# EasyEDA schematic SCH_hackercard_2026-05-06.json
TITLE: Sheet_1; REV: 1.0; Date: 2026-04-28; Sheet: 1/1; Company: Your Company
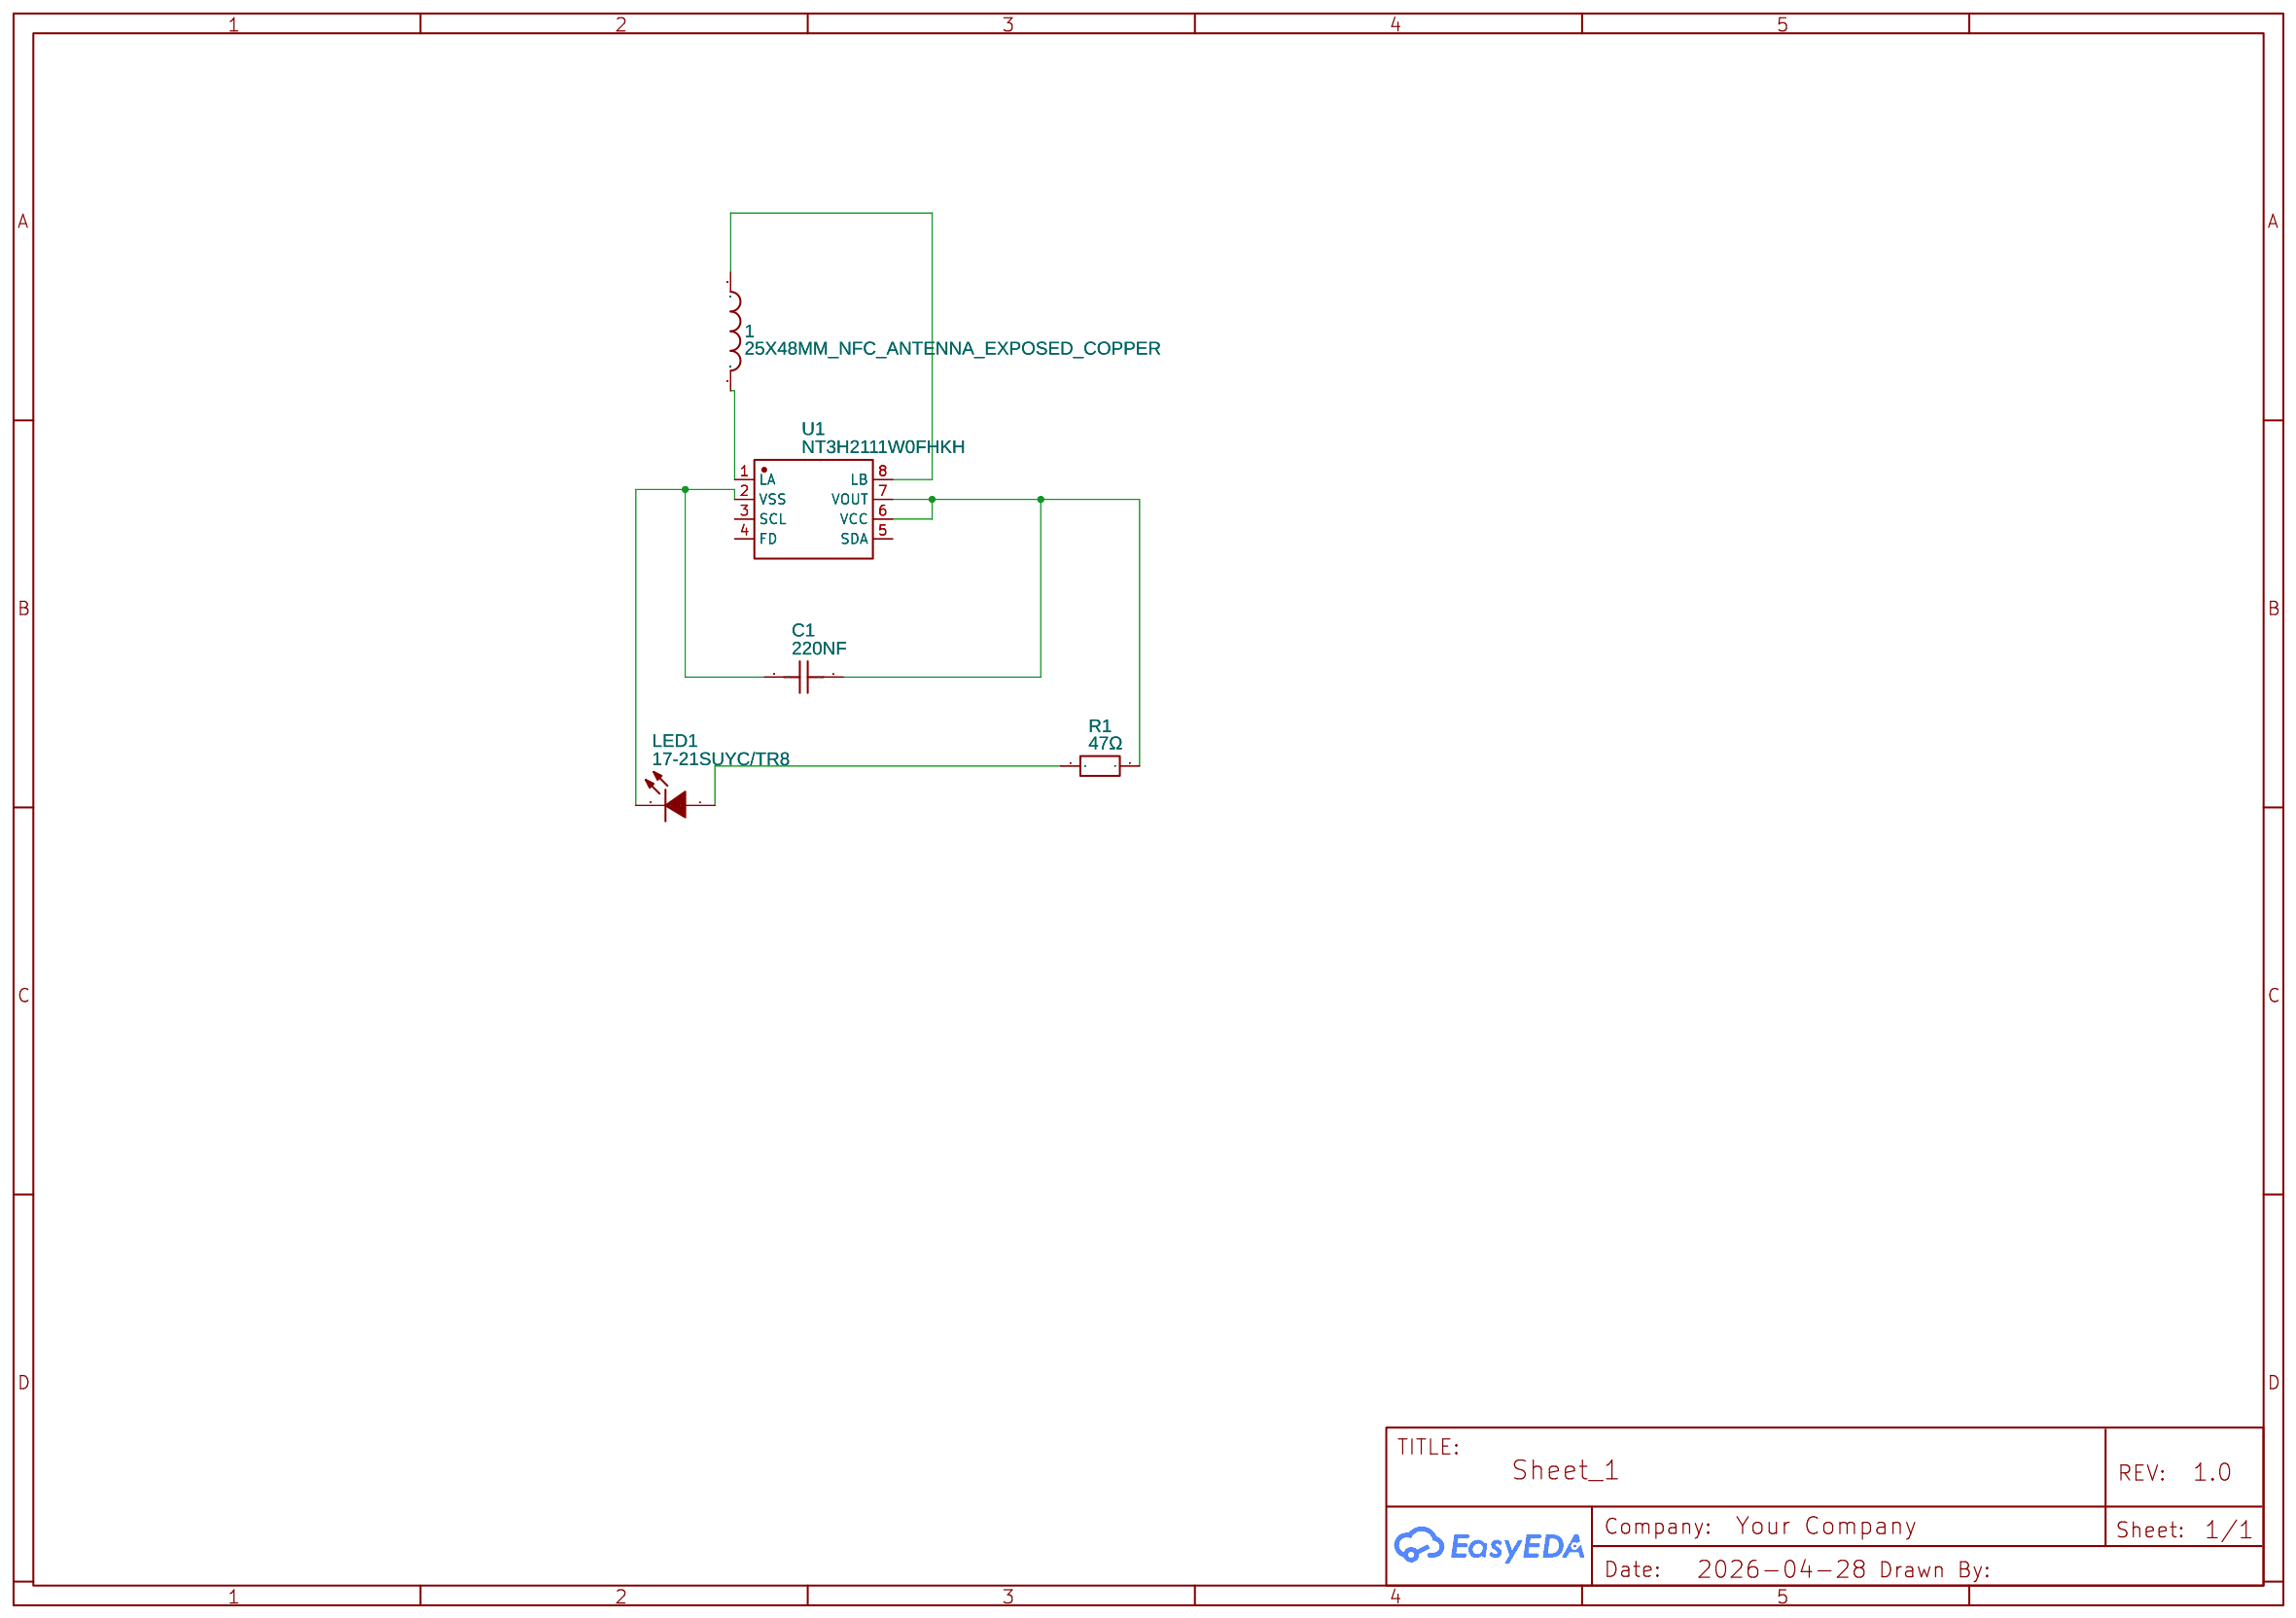
[diagram p0: schematic sheet]

## Parts
1  25X48MM_NFC_ANTENNA_EXPOSED_COPPER  [25X48MM_NFC_ANTENNA]
C1  220NF  [C0603]
LED1  17-21SUYC/TR8  [LED0805-R-RD]
R1  47Ω  [R0603_SMD-CRCW060327R0FKEA]
U1  NT3H2111W0FHKH  [XQFN-8_L1.6-W1.6-P0.50-BL_NT3H2111W0FHKH]

## Library data of the parts
1 = 25X48MM_NFC_ANTENNA_EXPOSED_COPPER: Contributor: goshawk222
C1 = 220NF: Supplier: LCSC; Supplier Part: C9900010081; Manufacturer: null; Manufacturer Part: 220nF; Contributor: lcsc; JLCPCB Part Class: Extended Part
LED1 = 17-21SUYC/TR8: Supplier: LCSC; Manufacturer: KENTO; Manufacturer Part: KT-0805黄灯; Supplier Part: C2296; JLCPCB Part Class: Basic Part
R1 = RC2512FK-7W16RL: Supplier: LCSC; Supplier Part: C6757834; Manufacturer: YAGEO(国巨); JLCPCB Part Class: Extended Part; Contributor: lcsc
U1 = NT3H2111W0FHKH: Contributor: LCSC; Supplier: LCSC; Supplier Part: C710403; Manufacturer: NXP(恩智浦); JLCPCB Part Class: Extended Part

## Nets
Net-(1-P$1): 1.P$1 U1.8(LB)
Net-(1-P$2): 1.P$2 U1.1(LA)
Net-(C1-1): C1.1 R1.2 U1.6(VCC) U1.7(VOUT)
Net-(C1-2): C1.2 LED1.2(-) U1.2(VSS)
Net-(LED1-1): LED1.1(+) R1.1

Not connected (* = marked no-connect by the designer): U1 3(SCL) 4(FD) 5(SDA)
